# EasyEDA Pro project ShengLiBan_v1.0.eprj

# Schematic ShengLiBan_v1.0
Create Date: 2023-11-09; Page Name: P1; Project Name: ShengLiBan_v1.0; Schematic Name: ShengLiBan_v1.0; Update Date: 2023-11-09; Company: 嘉立创EDA; Page Size: A4; Version: V1.0
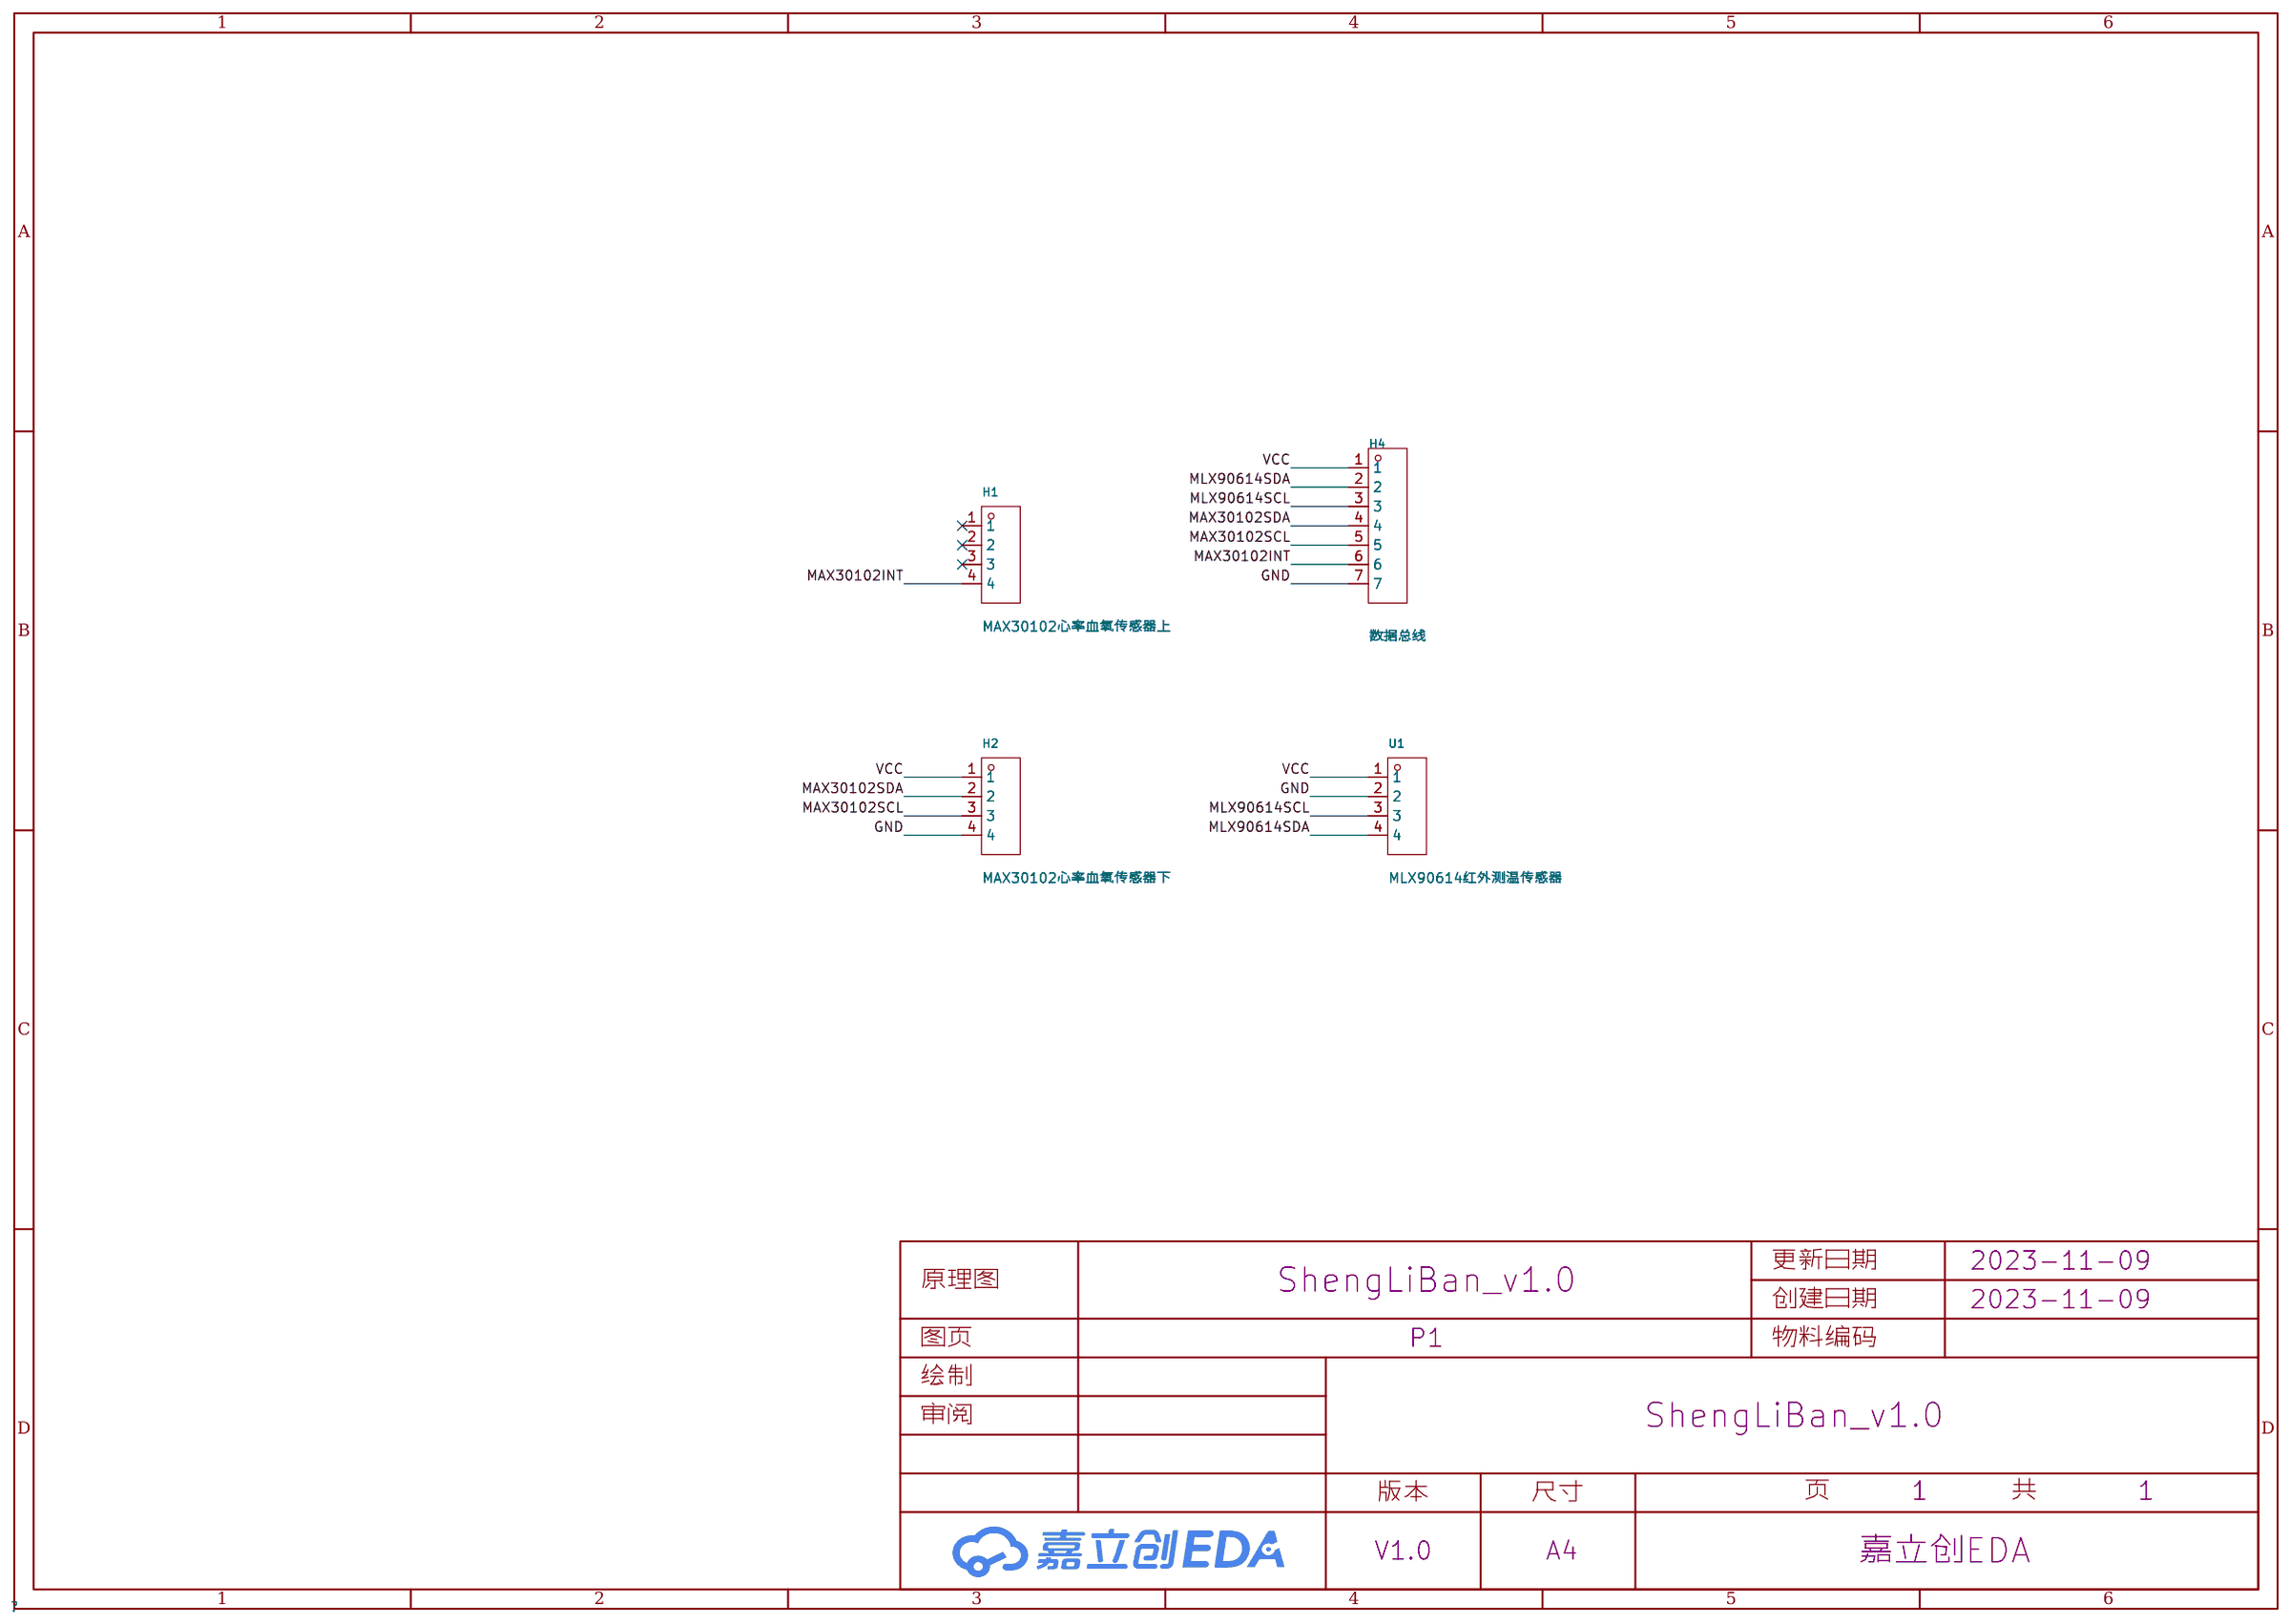
[diagram p0: schematic sheet]

## Parts
H1  MAX30102心率血氧传感器上  [HDR-TH_4P-P2.54-V-M]
H2  MAX30102心率血氧传感器下  [HDR-TH_4P-P2.54-V-M]
H4  数据总线  [HDR-TH_7P-P2.54-V-M]
U1  MLX90614红外测温传感器  [HDR-TH_4P-P2.54-H-F-W10.0-N]

## Library data of the parts
H1 H2 = PZ254V-11-04P: 排数:单排;总PIN位数:4P;间距:2.54mm;插针结构:1x4P;行距:-;安装类型:直插;圆针/方针:方针;额定电流:3A;额定电压:250V;配合针长度:6mm;塑高:2.5mm;端接针长度:3mm;触头材质:-;工作温度范围:-40℃~+105℃;颜色:黑色;; LCSC Part Name: 2.54mm 1x4P 直插 方针; Supplier Part: C2691448; Manufacturer: XFCN(兴飞); Supplier Footprint: 插件,P=2.54mm; JLCPCB Part Class: 扩展库; Datasheet: https://atta.szlcsc.com/upload/public/pdf/source/20200309/C492403_F9F19131791D08044AD4F84F8E751A34.pdf; Supplier: LCSC; Number of Rows: 单排; Number of Pins: 4P; Pitch: 2.54mm; Pin Structure: 1x4P; Mounting Type: 直插; Circluar Pins/Square Pins: 方针; Current Rating (Max): 3A; Voltage Rating (Max): 250V; Length of Mating Pin: 6mm; Insulation Height: 2.5mm; Length of End Connection Pin: 3mm; Operating Temperature Range: -40℃~+105℃; Color: 黑色
H4 = PZ254V-11-07P: 排数:单排;总PIN位数:7P;间距:2.54mm;插针结构:1x7P;行距:-;安装类型:直插;圆针/方针:方针;额定电流:-;额定电压:-;配合针长度:6mm;塑高:2.5mm;端接针长度:3mm;触头材质:黄铜;触头镀层:-;工作温度范围:-40℃~+105℃;颜色:黑色;; LCSC Part Name: 2.54mm 1x7P 直插 方针; Supplier Part: C492406; Manufacturer: XFCN(兴飞); Supplier Footprint: 插件,P=2.54mm; JLCPCB Part Class: 扩展库; Datasheet: https://atta.szlcsc.com/upload/public/pdf/source/20200309/C492406_654C533EE691117E22DD9F76C114C2D9.pdf; Supplier: LCSC; Number of Rows: 单排; Number of Pins: 7P; Pitch: 2.54mm; Pin Structure: 1x7P; Mounting Type: 直插; Circluar Pins/Square Pins: 方针; Length of Mating Pin: 6mm; Insulation Height: 2.5mm; Length of End Connection Pin: 3mm; Contact Material: 黄铜; Operating Temperature Range: -40℃~+105℃; Color: 黑色
U1 = PM254-1-04-W-8.5: 排数:单排;总孔位数:4P;间距:2.54mm;插孔结构:1x4P;行距:-;安装类型:弯插;圆孔/方孔:方孔;额定电流:3A;额定电压:-;插孔方向:侧面;塑高:8.5mm;工作温度范围:-40℃~+105℃;; LCSC Part Name: 2.54mm 1x4P; Supplier Part: C2897386; Manufacturer: HCTL(华灿天禄); Supplier Footprint: 弯插,P=2.54mm; JLCPCB Part Class: 扩展库; Datasheet: https://atta.szlcsc.com/upload/public/pdf/source/20230609/7BA40A3D721268A082DCDEAD4C99131B.pdf; Supplier: LCSC; Number of Rows: 单排; Number of Holes: 4P; Pitch: 2.54mm; Holes Structure: 1x4P; Mounting Type: 弯插; Circular Hole / Square Hole: 方孔; Current Rating (Max): 3A; Holes Direction: 侧面; Insulation Height: 8.5mm; Operating Temperature Range: -40℃~+105℃

## Nets
GND: H2.4 H4.7 U1.2
VCC: H2.1 H4.1 U1.1
MAX30102INT: H1.4 H4.6
MAX30102SCL: H2.3 H4.5
MAX30102SDA: H2.2 H4.4
MLX90614SCL: H4.3 U1.3
MLX90614SDA: H4.2 U1.4

Not connected (* = marked no-connect by the designer): H1 1* 2* 3*

# Board PCB1
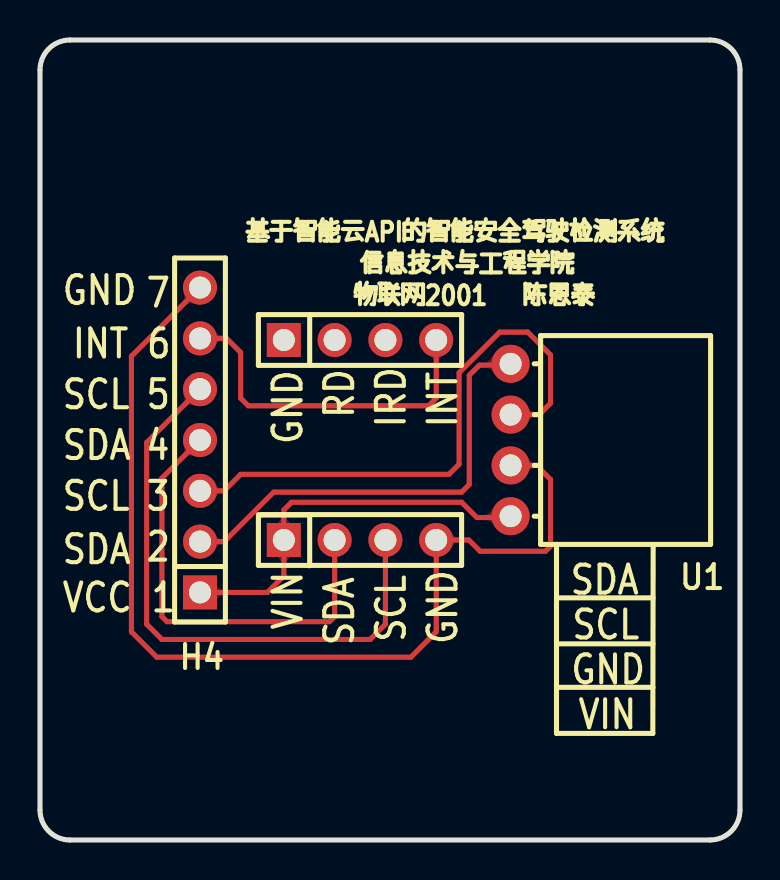
[diagram p1: board, top side]
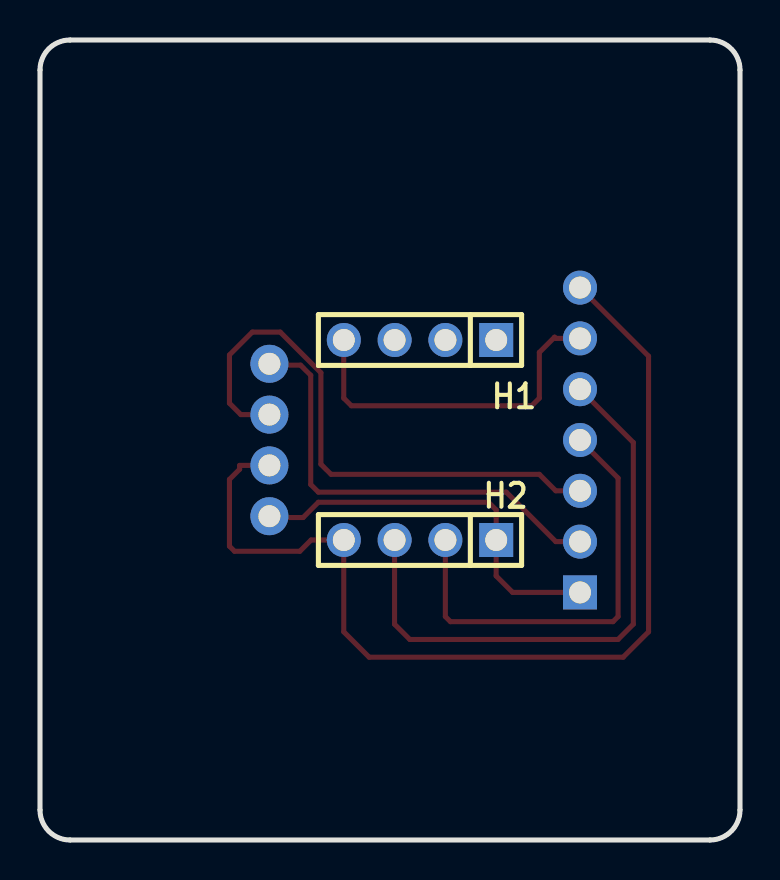
[diagram p2: board, bottom side, seen from below]

Outline 35 x 40 mm; copper layers: Top Layer, Bottom Layer. Coordinates in mm from the lower left corner of the outline.
Outline path: 0,38.5 0,1.5 arc(0.44,0.44) 1.5,0 33.5,0 arc(34.56,0.44) 35,1.5 35,38.5 arc(34.56,39.56) 33.5,40 1.5,40 arc(0.44,39.56) 0,38.5
Stack: Top Layer 0.035mm / Dielectric1 1.51mm FR4 er 4.5 / Bottom Layer 0.035mm

## Design rules (mm)
template: JLCPCB Capability(Two Layers Board)
spacing copperThickness1oz (default): track to track 0.102, other pairs 0.152 to 0.3
spacing copperThickness2oz: track to track 0.203, other pairs 0.152 to 0.3
track width copperThickness1oz (default): min 0.127, default 0.254, max 2.54
track width copperThickness2oz: min 0.203, default 0.254, max 2.54
differential pair differentialPair (default): width min 0.127, default 0.254, max 2.54; gap min 0.152, default 0.152
via viaSize (default): diameter min 0.5, default 0.61, max 10; hole min 0.3, default 0.305, max 6.3

## Placement (name value [footprint] x y rotation side)
H1  MAX30102心率血氧传感器上  [HDR-TH_4P-P2.54-V-M]  16 25 0 bottom
H2  MAX30102心率血氧传感器下  [HDR-TH_4P-P2.54-V-M]  16 15 0 bottom
H4  数据总线  [HDR-TH_7P-P2.54-V-M]  8 20 90 top
U1  MLX90614红外测温传感器  [HDR-TH_4P-P2.54-H-F-W10.0-N]  23.53 20 90 top

## Footprints (pads in the part's own frame, mm; a bottom-side part is the same pattern mirrored in y, then rotated)
HDR-TH_4P-P2.54-H-F-W10.0-N
  round 1.9 hole 1.1: 1(-3.81,0) 2(-1.27,0) 3(1.27,0) 4(3.81,0)
HDR-TH_4P-P2.54-V-M
  rect 1.7x1.7 hole 1.1: 1(-3.81,0)
  round 1.7 hole 1.1: 2(-1.27,0) 3(1.27,0) 4(3.81,0)
HDR-TH_7P-P2.54-V-M
  rect 1.7x1.7 hole 1.1: 1(-7.62,0)
  round 1.7 hole 1.1: 2(-5.08,0) 3(-2.54,0) 4(0,0) 5(2.54,0) 6(5.08,0) 7(7.62,0)

## Nets
As in the schematic.

Pads without a net: H1 1 2 3

## Via types
v1: diameter 0.61, hole 0.305, Top Layer to Bottom Layer, 7 vias

## Routing (per net, layer and track width the routed paths; a pad name or vN(x,y) marks a point on that pad's centre or on a via; arc(x,y) is an arc through that point)
GND: length 51.3
  Top Layer w0.254: U1.2 25.02,18.73 25.02,18.54 25.53,18.03 25.53,14.69 25.27,14.44 22.01,14.44 21.44,15 v1(19.81,15) v1(19.81,15) 19.81,10.41 18.54,9.14 5.84,9.14 4.57,10.41 4.57,24.19 H4.7
VCC: length 19.7
  Top Layer w0.254: U1.1 23.46,16.12 21.84,16.12 21.08,16.89 12.57,16.89 12.19,16.5 v1(12.19,15) 12.19,15 12.19,13.2 11.37,12.38 H4.1
MAX30102INT: length 17.7
  Top Layer w0.254: H4.6 9.21,25.08 9.27,25.14 10.03,24.38 10.03,22.09 10.41,21.71 19.43,21.71 19.81,22.09 v1(19.81,25) v1(19.81,25)
MAX30102SCL: length 29.6
  Top Layer w0.254: H4.5 5.33,19.87 5.33,10.79 6.1,10.03 16.51,10.03 17.27,10.79 v1(17.27,15) H2.3
MAX30102SDA: length 22.3
  Top Layer w0.254: H2.2 v1(14.73,15) 14.73,11.17 14.48,10.92 6.35,10.92 6.1,11.17 6.1,18.1 H4.4
MLX90614SCL: length 28.6
  Top Layer w0.254: H4.3 9.21,17.46 10.03,18.28 20.45,18.28 20.96,18.79 20.96,23.36 22.99,25.39 24.38,25.39 25.53,24.25 25.53,21.84 24.96,21.27 U1.3
MLX90614SDA: length 22.4
  Top Layer w0.254: U1.4 23.46,23.74 21.97,23.74 21.46,23.24 21.46,17.78 21.08,17.39 11.68,17.39 9.21,14.92 H4.2

## Copper pours and planes (outline as drawn; the poured copper is in the pictures)
GND on Top Layer: -1.65,41.78 36.83,41.78 36.83,-2.16 -1.65,-2.16
GND on Bottom Layer: -1.65,41.78 36.58,41.78 36.58,-1.66 -1.65,-1.66

Small or netless copper shapes (teardrops, artwork), in the pictures only: 16 on Top Layer

## Text on the board
Top Silkscreen Layer: GND | SCL | SDA | VCC | INT | 4 | 7 | 5 | 3 | 2 | 6 | 1 | VIN | RD | IRD | 基于智能云API的智能安全驾驶检测系统 | 物联网2001   陈恩泰 | 信息技术与工程学院
